# Altium project Watch.PrjPcb
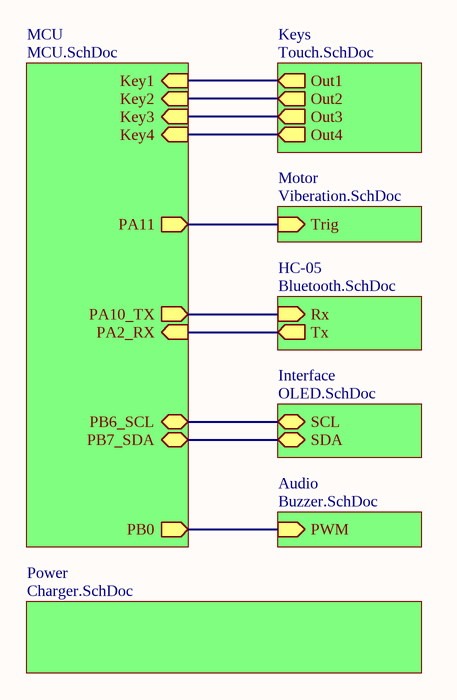
[diagram p0: main.SchDoc]
9 sheets, 53 parts. Net scope: hierarchical (ports join the sheet entries above them; power ports are global).
Board file: watch_pcb.PcbDoc
Sheets:
  main.SchDoc
    MCU = MCU.SchDoc
    HC-05 = Bluetooth.SchDoc
    Motor = Viberation.SchDoc
    Interface = OLED.SchDoc
    Keys = Touch.SchDoc
    Audio = Buzzer.SchDoc
    Power = Charger.SchDoc
  GyroMPU.SchDoc

## Sheet main.SchDoc
size 209 x 148 mm

### Sub-sheets
Audio = Buzzer.SchDoc: PWM (in)
HC-05 = Bluetooth.SchDoc: Rx (in), Tx (out)
Interface = OLED.SchDoc: SCL (bidir), SDA (bidir)
Keys = Touch.SchDoc: Out4 (out), Out2 (out), Out1 (out), Out3 (out)
MCU = MCU.SchDoc: PA10_TX (out), PA2_RX (in), PB7_SDA (bidir), PB6_SCL (bidir), Key1 (in), Key2 (in), Key3 (in), Key4 (in), PB0 (out), PA11 (out)
Motor = Viberation.SchDoc: Trig (in)
Power = Charger.SchDoc: no entries

### Nets
NetBT1_1: sheet MCU/PA2_RX, sheet HC-05/Tx
NetBT1_2: sheet MCU/PA10_TX, sheet HC-05/Rx
NetM1_1: sheet MCU/PA11, sheet Motor/Trig
NetM2_1: sheet MCU/PB0, sheet Audio/PWM
NetOLED_2: sheet MCU/PB7_SDA, sheet Interface/SDA
NetOLED_3: sheet MCU/PB6_SCL, sheet Interface/SCL
NetU1_38: sheet MCU/Key1, sheet Keys/Out1
NetU1_39: sheet MCU/Key2, sheet Keys/Out2
NetU1_40: sheet MCU/Key3, sheet Keys/Out3
NetU1_41: sheet MCU/Key4, sheet Keys/Out4

## Sheet MCU.SchDoc
size A4
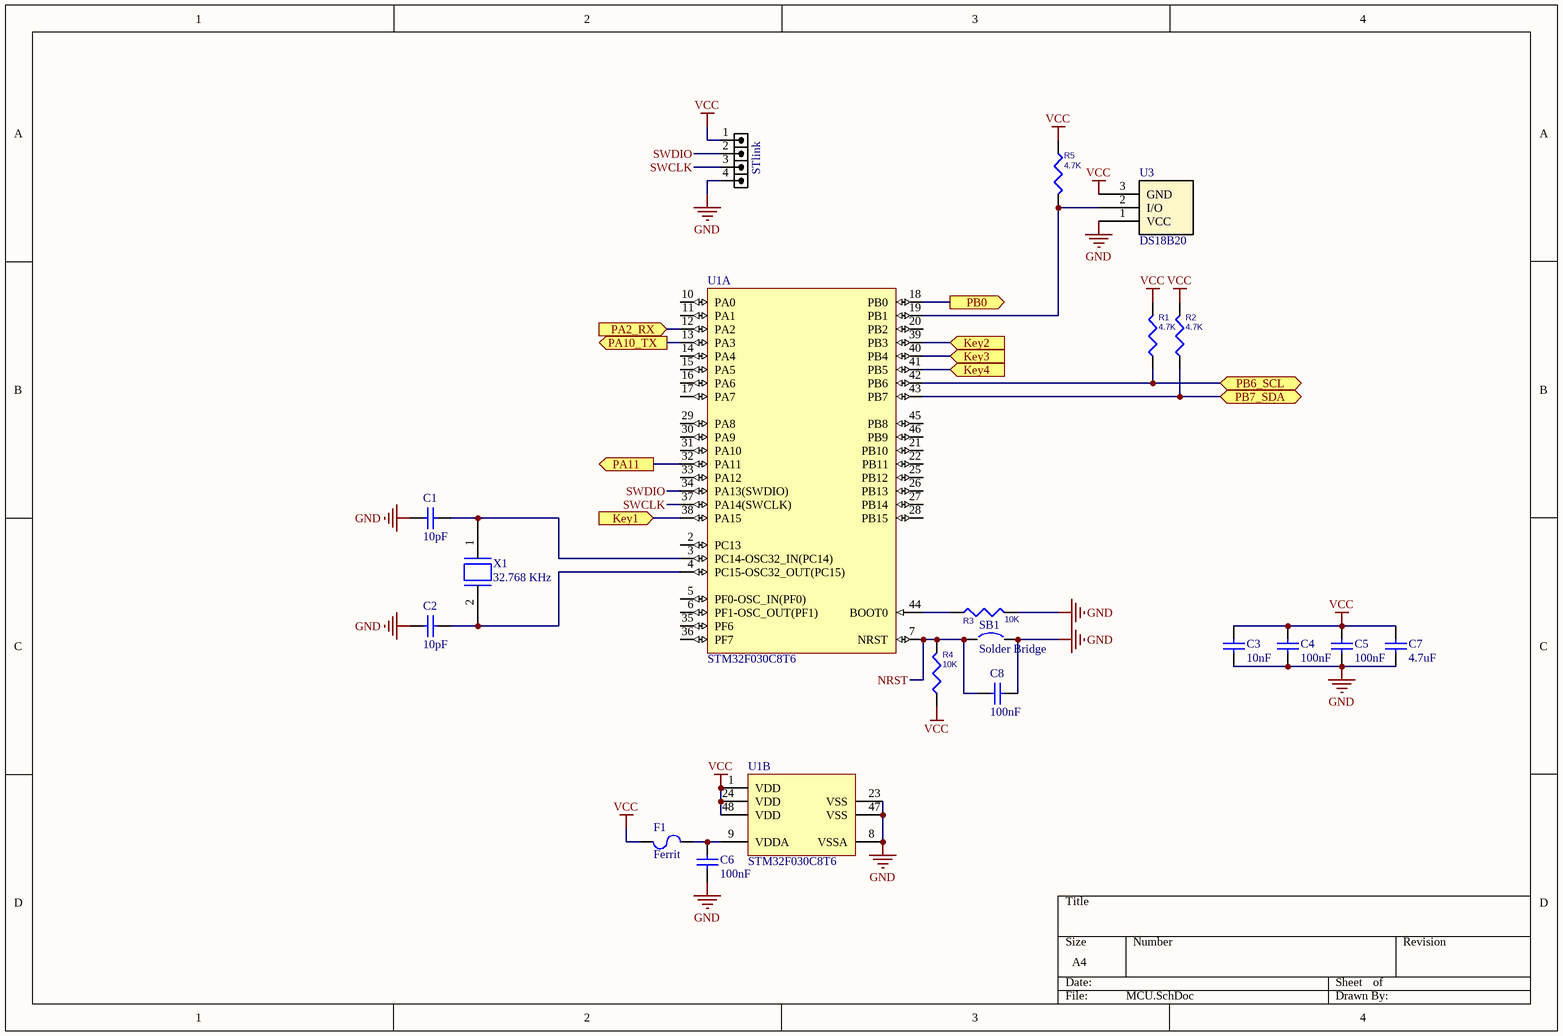
[diagram p1: MCU.SchDoc]

### Parts
C1  10pF  [0603C]
C2  10pF  [0603C]
C3  10nF  [0603C]
C4  100nF  [0603C]
C5  100nF  [0603C]
C6  100nF  [0603C]
C7  4.7uF  [0603C]
C8  100nF  [0603C]
F1  Ferrit  [0805F]
R1  4.7K  [0603R]
R2  4.7K  [0603R]
R3  10K  [0603R]
R4  10K  [0603R]
R5  4.7K  [0603R]
SB1  Solder Bridge  [Solder Bridge]
STlink  HDR1X4  [HDRR_M_1X4]  (value not drawn)
U1  STM32F030C8T6  [LQFP-48 7x7MM P0.5MM]  (parts A,B of 2)
U3  DS18B20  [TO-92]
X1  32.768 KHz  [32.768 - Right]

### Ports
Key1 (in), Key2 (in), Key3 (in), Key4 (in), PA2_RX (in), PA10_TX (out), PA11 (out), PB0 (out), PB6_SCL (bidir), PB7_SDA (bidir)

### Nets
GND: C1.1 C2.1 C3.1 C4.1 C5.1 C6.1 C7.1 C8.2 R3.2 SB1.2 STlink.4 U1.8(VSSA) U1.23(VSS) U1.47(VSS) U3.1(VCC)
VCC: C3.2 C4.2 C5.2 C7.2 F1.1 R1.2 R2.2 R4.1 R5.2 STlink.1 U1.1(VDD) U1.24(VDD) U1.48(VDD) U3.3(GND)
NRST: C8.1 R4.2 SB1.1 U1.7(NRST)
SWCLK: STlink.3 U1.37(PA14(SWCLK))
SWDIO: STlink.2 U1.34(PA13(SWDIO))
NetBT1_1: U1.12(PA2) ; port PA2_RX
NetBT1_2: U1.13(PA3) ; port PA10_TX
NetC1_2: C1.2 U1.3(PC14-OSC32_IN(PC14)) X1.1
NetC2_2: C2.2 U1.4(PC15-OSC32_OUT(PC15)) X1.2
NetC6_2: C6.2 F1.2 U1.9(VDDA)
NetM1_1: U1.32(PA11) ; port PA11
NetM2_1: U1.18(PB0) ; port PB0
NetOLED_2: R2.1 U1.43(PB7) ; port PB7_SDA
NetOLED_3: R1.1 U1.42(PB6) ; port PB6_SCL
NetR3_1: R3.1 U1.44(BOOT0)
NetR5_1: R5.1 U1.19(PB1) U3.2(I/O)
NetU1_38: U1.38(PA15) ; port Key1
NetU1_39: U1.39(PB3) ; port Key2
NetU1_40: U1.40(PB4) ; port Key3
NetU1_41: U1.41(PB5) ; port Key4

Not connected (* = marked no-connect by the designer): U1 2(PC13) 5(PF0-OSC_IN(PF0)) 6(PF1-OSC_OUT(PF1)) 10(PA0) 11(PA1) 14(PA4) 15(PA5) 16(PA6) 17(PA7) 20(PB2) 21(PB10) 22(PB11) 25(PB12) 26(PB13) 27(PB14) 28(PB15) 29(PA8) 30(PA9) 31(PA10) 33(PA12) 35(PF6) 36(PF7) 45(PB8) 46(PB9)

### Library data of the parts
C1-C8 = Cap: Capacitor
  C1 C2: Value: 10pF
  C3: Value: 10nF
  C4-C6 C8: Value: 100nF
  C7: Value: 4.7uF
F1 = Fuse SMD: Ferrit 0805; ComponentLink1Description: Digikey; ComponentLink1URL: https://www.digikey.com/short/pz37qm; CurrentRating: Ferrit
R1-R5 = R
  R1 R2 R5: Value: 4.7K
  R3 R4: Value: 10K
STlink = HDRR_M_1X4: CONN, HEADER, RightAngle, Male, pitch: 2.54mm, 4POS; VALUE: HDRM4
U1 = STM32F030C8T6: ARM Cortex-M0 32-bit MCU, 64 KB Flash, 8 KB Internal RAM, 39 I/Os, 48-pin LQFP, -40 to 85 degC, Tray; FLASH Size (Prog) (kB): 64; I/Os (High Current): 39; Internal RAM Size (kB): 8; Operating Frequency(F) (Processor speed) (MHz): 48; Supply Voltage(Vcc) min (V): 2.4; DatasheetVersion: Rev. 1; PackageVersion: Rev. 6, 06/2013; PackageReference: LQFP48; PackageDescription: 48-Pin Low Profile Quad Flat Package, 7 x 7 mm Body, 0.5 mm Pitch; Supplier 1: Digi-Key; Supplier Part Number 1: 497-14043-ND; Supplier 2: Newark; Supplier Part Number 2: 06X3647; Supplier 3: Mouser; Supplier Part Number 3: 511-STM32F030C8T6; Core: ARM Cortex-M0; Packing: Tray; Mounting Technology: Surface Mount; PartNumber: STM32F030C8T6; ComponentLink1Description: Manufacturer URL; ComponentLink1URL: http://www.st.com/web/en/home.html; ComponentLink2Description: Datasheet; ComponentLink2URL: http://www.st.com/st-web-ui/static/active/en/resource/technical/document/datasheet/DM00088500.pdf; ComponentLink3Description: Package Specification; ComponentLink3URL: http://www.st.com/st-web-ui/static/active/en/resource/technical/document/datasheet/DM00058181.pdf
X1 = XTAL: Frequency: 32.768 KHz

## Sheet Bluetooth.SchDoc
size 209 x 148 mm
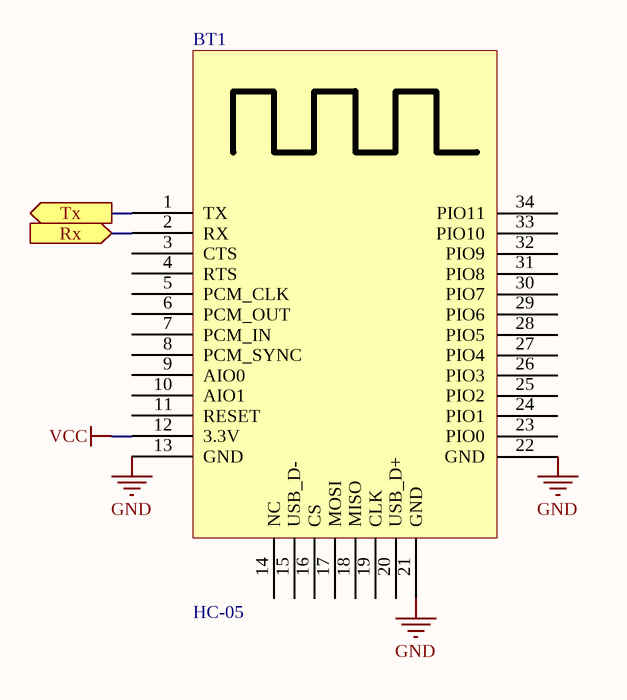
[diagram p2: Bluetooth.SchDoc]

### Parts
BT1  HC-05  [HC-05]

### Ports
Rx (in), Tx (out)

### Nets
GND: BT1.13(GND) BT1.21(GND) BT1.22(GND)
VCC: BT1.12(3.3V)
NetBT1_1: BT1.1(TX) ; port Tx
NetBT1_2: BT1.2(RX) ; port Rx

Not connected (* = marked no-connect by the designer): BT1 3(CTS) 4(RTS) 5(PCM_CLK) 6(PCM_OUT) 7(PCM_IN) 8(PCM_SYNC) 9(AIO0) 10(AIO1) 11(RESET) 14(NC) 15(USB_D-) 16(CS) 17(MOSI) 18(MISO) 19(CLK) 20(USB_D+) 23(PIO0) 24(PIO1) 25(PIO2) 26(PIO3) 27(PIO4) 28(PIO5) 29(PIO6) 30(PIO7) 31(PIO8) 32(PIO9) 33(PIO10) 34(PIO11)

## Sheet Viberation.SchDoc
size 209 x 148 mm
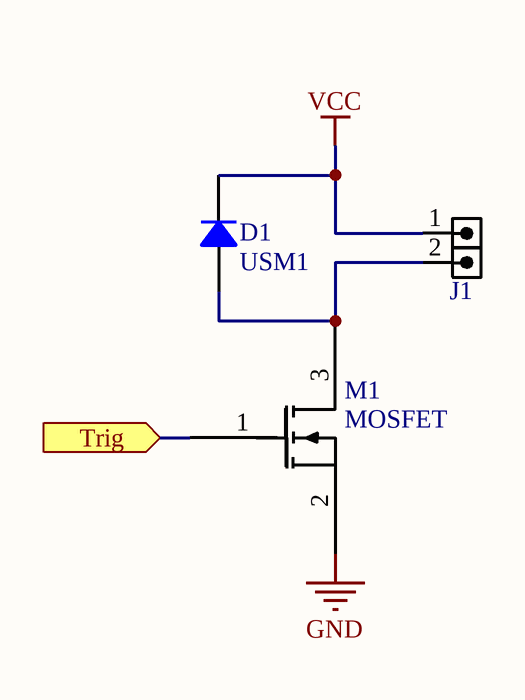
[diagram p3: Viberation.SchDoc]

### Parts
D1  USM1  [DO-214AC SMA]
J1  HDR2  [HDR1SE_M_1X2]  (value not drawn)
M1  MOSFET  [SOT-23]

### Ports
Trig (in)

### Nets
GND: M1.2
VCC: D1.2 J1.1
NetD1_1: D1.1 J1.2 M1.3
NetM1_1: M1.1 ; port Trig

### Library data of the parts
D1 = US1M (SMD SMA): Diode Standard 1000V 1A Surface Mount SMA; PartNumber: US1M-13-F
J1 = HDRTST_1X2: HEADER, 1mm pitch, test, SMD; VALUE: HDR2
M1 = 2N7002A

## Sheet OLED.SchDoc
size 209 x 148 mm
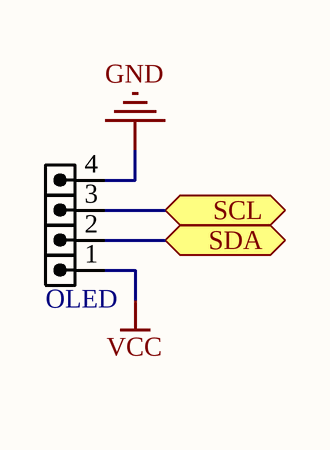
[diagram p4: OLED.SchDoc]

### Parts
OLED  HDR4  [HDR1SE_M_1X4]  (value not drawn)

### Ports
SCL (bidir), SDA (bidir)

### Nets
GND: OLED.4
VCC: OLED.1
NetOLED_2: OLED.2 ; port SDA
NetOLED_3: OLED.3 ; port SCL

### Library data of the parts
OLED = HDRTST_1X4: HEADER, 1mm pitch, test, SMD; VALUE: HDR4

## Sheet Touch.SchDoc
size 209 x 148 mm
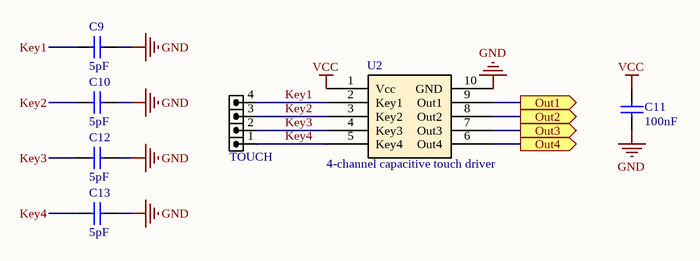
[diagram p5: Touch.SchDoc]

### Parts
C9  5pF  [0603C]
C10  5pF  [0603C]
C11  100nF  [0603C]
C12  5pF  [0603C]
C13  5pF  [0603C]
TOUCH  HDR4  [HDR1SE_M_1X4]  (value not drawn)
U2  4-channel capacitive touch driver  [MSOP-10]

### Ports
Out1 (out), Out2 (out), Out3 (out), Out4 (out)

### Nets
GND: C9.1 C10.1 C11.1 C12.1 C13.1 U2.10(GND)
VCC: C11.2 U2.1(Vcc)
Key1: C9.2 TOUCH.4 U2.2(Key1)
Key2: C10.2 TOUCH.3 U2.3(Key2)
Key3: C12.2 TOUCH.2 U2.4(Key3)
Key4: C13.2 TOUCH.1 U2.5(Key4)
NetU1_38: U2.9(Out1) ; port Out1
NetU1_39: U2.8(Out2) ; port Out2
NetU1_40: U2.7(Out3) ; port Out3
NetU1_41: U2.6(Out4) ; port Out4

### Library data of the parts
C9-C13 = Cap: Capacitor
  C9 C10 C12 C13: Value: 5pF
  C11: Value: 100nF
TOUCH = HDRTST_1X4: HEADER, 1mm pitch, test, SMD; VALUE: HDR4
U2 = BS814A-1

## Sheet Buzzer.SchDoc
size 209 x 148 mm
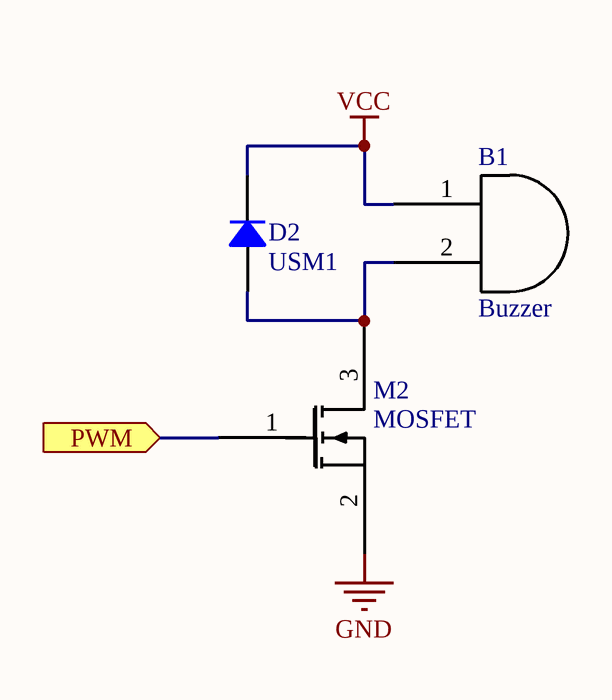
[diagram p6: Buzzer.SchDoc]

### Parts
B1  Buzzer  [BUZZER-CSPT12A]
D2  USM1  [DO-214AC SMA]
M2  MOSFET  [SOT-23]

### Ports
PWM (in)

### Nets
GND: M2.2
VCC: B1.1 D2.2
NetB1_2: B1.2 D2.1 M2.3
NetM2_1: M2.1 ; port PWM

### Library data of the parts
D2 = US1M (SMD SMA): as D1 on sheet Viberation
M2 = 2N7002A

## Sheet Charger.SchDoc
size A4
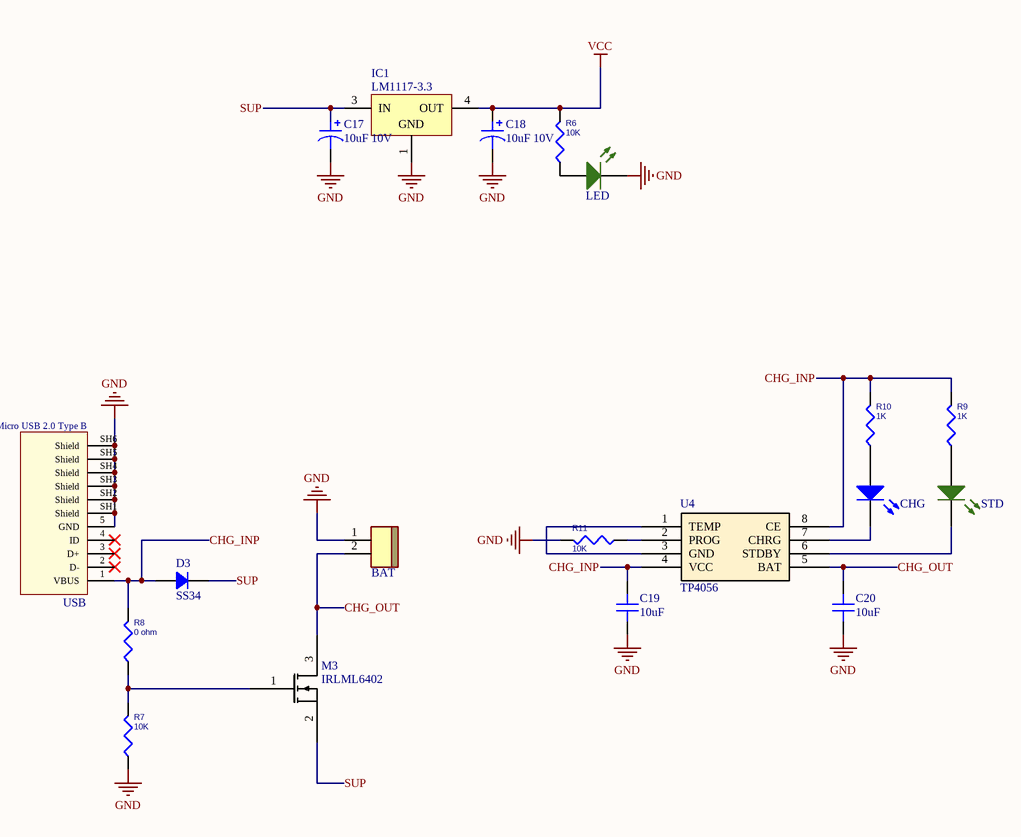
[diagram p7: Charger.SchDoc]

### Parts
BAT  JST BxB-PH-K 2Pin  [JST B2B-PH-K]  (value not drawn)
C17  10uF 10V  [CAP TANSMD 1206_3216 CASE A]
C18  10uF 10V  [CAP TANSMD 1206_3216 CASE A]
C19  10uF  [CAP 0603_1608]
C20  10uF  [CAP 0603_1608]
CHG  LED SMD 0603 BLUE  [LED_0603_RED]  (value not drawn)
D3  SS34  [DO-214AC SMA]
IC1  LM1117-3.3  [TD03B_N]
LED  LED SMD 0603 GREEN  [LED_0603_GREEN]  (value not drawn)
M3  IRLML6402  [SOT-23]
R6  10K  [0603R]
R7  10K  [0603R]
R8  0 ohm  [0603R]
R9  1K  [0603R]
R10  1K  [0603R]
R11  10K  [0603R]
STD  LED SMD 0603 GREEN  [LED_0603_GREEN]  (value not drawn)
U4  TP4056  [SOIC-8]
USB  Micro USB 2.0 Type B  [USB_MICRO_B_BM_SHT]

### Nets
GND: BAT.1 C17.2 C18.2 C19.2 C20.2 IC1.1(GND) LED.2(K) R7.1 R11.2 USB.5(GND) USB.SH1(Shield) USB.SH2(Shield) USB.SH3(Shield) USB.SH4(Shield) USB.SH5(Shield) USB.SH6(Shield)
VCC: C18.1 IC1.4(OUT) R6.2
CHG_INP: C19.1 D3.1 R8.2 R9.2 R10.2 U4.4(VCC) U4.8(CE) USB.1(VBUS)
CHG_OUT: BAT.2 C20.1 M3.3 U4.5(BAT)
SUP: C17.1 D3.2 IC1.3(IN) M3.2
NetCHG_1: CHG.1(A) R10.1
NetCHG_2: CHG.2(K) U4.7(CHRG)
NetLED_1: LED.1(A) R6.1
NetM3_1: M3.1 R7.2 R8.1
NetR9_1: R9.1 STD.1(A)
NetR11_1: R11.1 U4.2(PROG)
NetSTD_2: STD.2(K) U4.6(STDBY)
NetU4_1: U4.1(TEMP) U4.3(GND)

Not connected (* = marked no-connect by the designer): USB 2(D-)* 3(D+)* 4(ID)*

### Library data of the parts
BAT = JST BxB-PH-K 2Pin: Connector Header Through Hole 0.079" (2.00mm); PartNumber: B2B-PH-K-S(LF)(SN)
C17 C18 = Cap Tan Case A: SMT Tantalum Capacitor; VALUE: 10uF 10V
C19 C20 = Cap 0603: SMT Capacitor; VALUE: 10uF
D3 = US1M (SMD SMA): Diode Standard 1000V 1A Surface Mount SMA; PartNumber: SS34
IC1 = LM1117DT-x.x: x.x Volt, 800mA Low-Dropout Linear Regulator, 3-pin TO-252; PartNumber: LM1117DT-3.3; Manufacturer: National Semiconductor; PackageTopMarking: NSUZXYTT*LM1117*DT-X.X; PowerWise: N; CompType: LDO IC; DatasheetVersion: Apr-2006; PackageVersion: revD, Feb-2009; PackageReference: TD03B; PackageDescription: TO252, Molded, Jedec, 6.8 x 6.10 x 2.30mm Body, 3 Lead, 2.28mm Pitch, Surface Mount; Supplier 1: Farnell; Supplier 2: Farnell; RoHS: N; PinCount: 3; Code_JEDEC: TO-252-AA; ComponentLink1Description: LM1117 Datasheet; ComponentLink1URL: http://www.national.com/ds/LM/LM1117.pdf; ComponentLink2Description: LM1117 Web Page; ComponentLink2URL: http://www.national.com/pf/LM/LM1117.html; ComponentLink3Description: TD03B Package Page; ComponentLink3URL: http://www.national.com/packaging/folders/td03b.html
M3 = 2N7002A: Name: IRLML6402
R6-R11 = R
  R6 R7 R11: Value: 10K
  R8: Value: 0 ohm
  R9 R10: Value: 1K
USB = Micro USB 2.0 Type B Horizonta (SMD) UB-MC5BR3-SD204-4S-1-TB NMP: USB - micro B  Receptacle Connector 5 Position Surface Mount, Right Angle; PartNumber: UB-MC5BR3-SD204-4S-1-TB NMP

## Sheet GyroMPU.SchDoc
size 209 x 148 mm
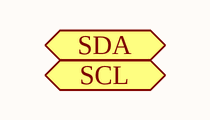
[diagram p8: GyroMPU.SchDoc]

### Ports
SCL (bidir), SDA (bidir)

## Nets that join several sheets
GND: MCU (15 pins), Bluetooth (BT1.13 BT1.21 BT1.22), Viberation (M1.2), OLED (OLED.4), Touch (6 pins), Buzzer (M2.2), Charger (16 pins)
VCC: MCU (14 pins), Bluetooth (BT1.12), Viberation (D1.2 J1.1), OLED (OLED.1), Touch (C11.2 U2.1), Buzzer (B1.1 D2.2), Charger (C18.1 IC1.4 R6.2)
NetBT1_1: MCU (U1.12), Bluetooth (BT1.1)
NetBT1_2: MCU (U1.13), Bluetooth (BT1.2)
NetM1_1: MCU (U1.32), Viberation (M1.1)
NetM2_1: MCU (U1.18), Buzzer (M2.1)
NetOLED_2: MCU (R2.1 U1.43), OLED (OLED.2)
NetOLED_3: MCU (R1.1 U1.42), OLED (OLED.3)
NetU1_38: MCU (U1.38), Touch (U2.9)
NetU1_39: MCU (U1.39), Touch (U2.8)
NetU1_40: MCU (U1.40), Touch (U2.7)
NetU1_41: MCU (U1.41), Touch (U2.6)